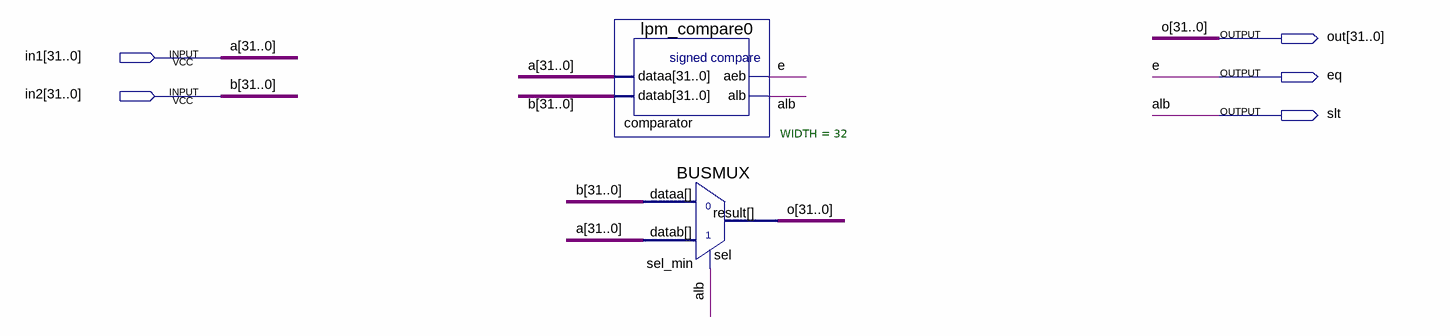
[diagram p0: schematic sheet]
// Quartus schematic comparator.bdf as structural Verilog: 2 symbols, 5 pins
module comparator (
  input  [31:0] in1,
  input  [31:0] in2,
  output [31:0] out,
  output eq,
  output slt
);

  lpm_compare0 comparator (.dataa(in1), .datab(in2), .aeb(eq), .alb(slt));
  BUSMUX #(.WIDTH(32)) sel_min (.datab(in1), .sel(slt), .dataa(in2), .result(out));

  // Other names for the same wires on the sheet: a[31:0] = in1; alb = slt; b[31:0] = in2; e = eq; o[31:0] = out
endmodule
